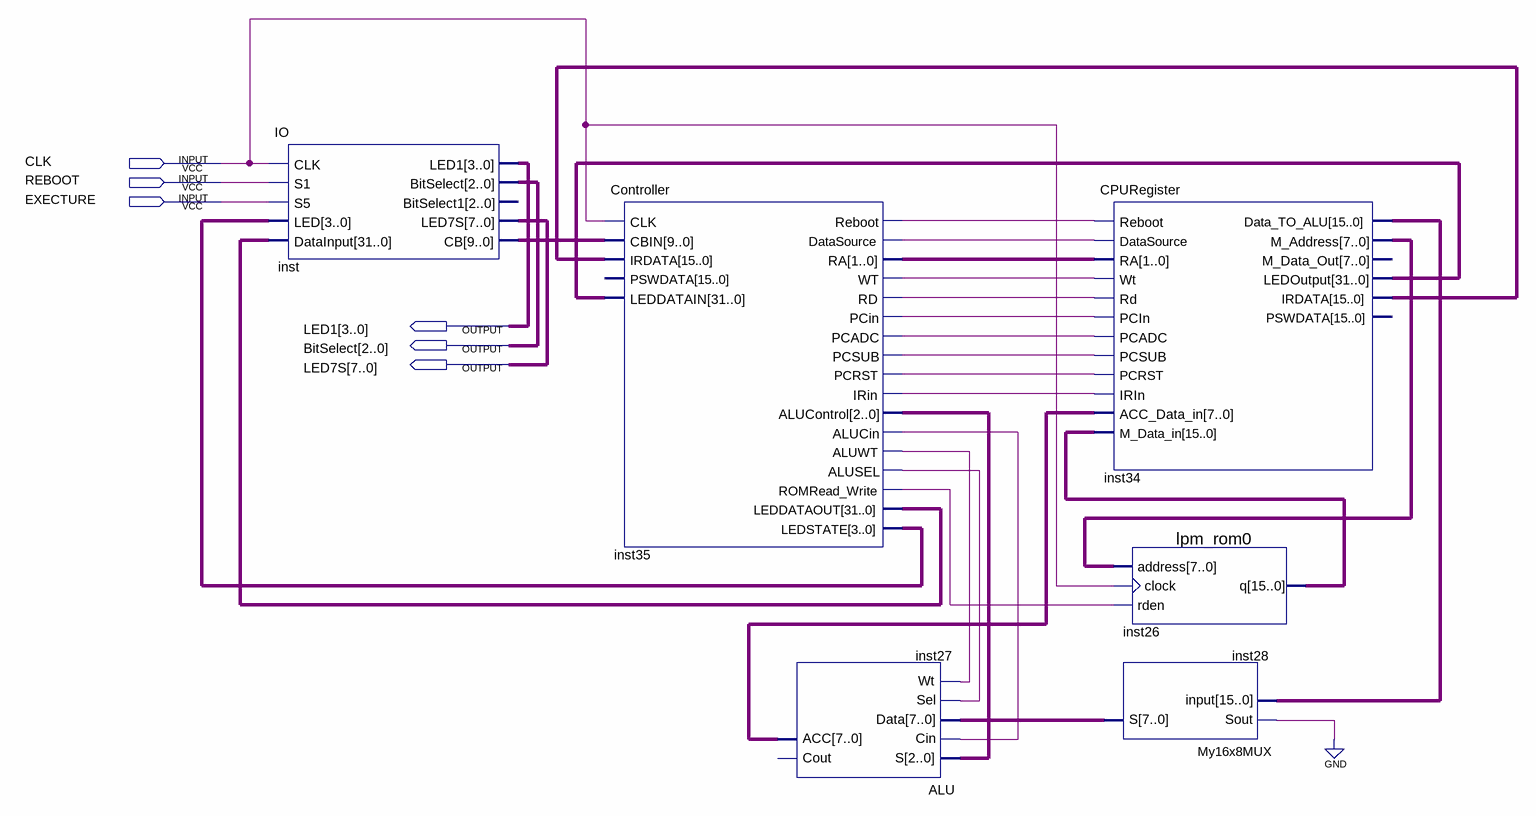
[diagram p0: schematic sheet]
// Quartus schematic TopLevelEntity.bdf as structural Verilog: 6 symbols, 6 pins
module TopLevelEntity (
  input  CLK,
  input  REBOOT,
  input  EXECTURE,
  output [3:0] LED1,
  output [2:0] BitSelect,
  output [7:0] LED7S
);

  wire inst35_alucin, inst35_alusel, inst35_aluwt, inst35_datasource, inst35_irin, inst35_pcadc, inst35_pcin,
       inst35_pcrst, inst35_pcsub, inst35_rd, inst35_reboot, inst35_romread_write, inst35_wt;
  wire [1:0] inst35_ra;
  wire [2:0] inst35_alucontrol;
  wire [3:0] inst35_ledstate;
  wire [7:0] inst27_acc, inst28_s, inst34_m_address;
  wire [9:0] inst_cb;
  wire [15:0] inst26_q, inst34_data_to_alu, inst34_irdata;
  wire [31:0] inst34_ledoutput, inst35_leddataout;

  IO inst (
    .CLK(CLK), .S1(REBOOT), .S5(EXECTURE), .LED(inst35_ledstate), .DataInput(inst35_leddataout), .LED1(LED1),
    .BitSelect(BitSelect), .LED7S(LED7S), .CB(inst_cb));  // open: BitSelect1
  Controller inst35 (
    .CLK(CLK), .CBIN(inst_cb), .IRDATA(inst34_irdata), .LEDDATAIN(inst34_ledoutput), .Reboot(inst35_reboot),
    .DataSource(inst35_datasource), .RA(inst35_ra), .WT(inst35_wt), .RD(inst35_rd), .PCin(inst35_pcin),
    .PCADC(inst35_pcadc), .PCSUB(inst35_pcsub), .PCRST(inst35_pcrst), .IRin(inst35_irin),
    .ALUControl(inst35_alucontrol), .ALUCin(inst35_alucin), .ALUWT(inst35_aluwt), .ALUSEL(inst35_alusel),
    .ROMRead_Write(inst35_romread_write), .LEDDATAOUT(inst35_leddataout), .LEDSTATE(inst35_ledstate));  // open: PSWDATA
  ALU inst27 (
    .S(inst35_alucontrol), .Cin(inst35_alucin), .Data(inst28_s), .Sel(inst35_alusel), .Wt(inst35_aluwt),
    .ACC(inst27_acc));  // open: Cout
  CPURegister inst34 (
    .Reboot(inst35_reboot), .DataSource(inst35_datasource), .RA(inst35_ra), .Wt(inst35_wt), .Rd(inst35_rd),
    .PCIn(inst35_pcin), .PCADC(inst35_pcadc), .PCSUB(inst35_pcsub), .PCRST(inst35_pcrst), .IRIn(inst35_irin),
    .ACC_Data_in(inst27_acc), .M_Data_in(inst26_q), .Data_TO_ALU(inst34_data_to_alu),
    .M_Address(inst34_m_address), .LEDOutput(inst34_ledoutput), .IRDATA(inst34_irdata));  // open: M_Data_Out, PSWDATA
  My16x8MUX inst28 (.Sout(1'b0), .\input (inst34_data_to_alu), .S(inst28_s));
  lpm_rom0 inst26 (.address(inst34_m_address), .clock(CLK), .rden(inst35_romread_write), .q(inst26_q));
endmodule
